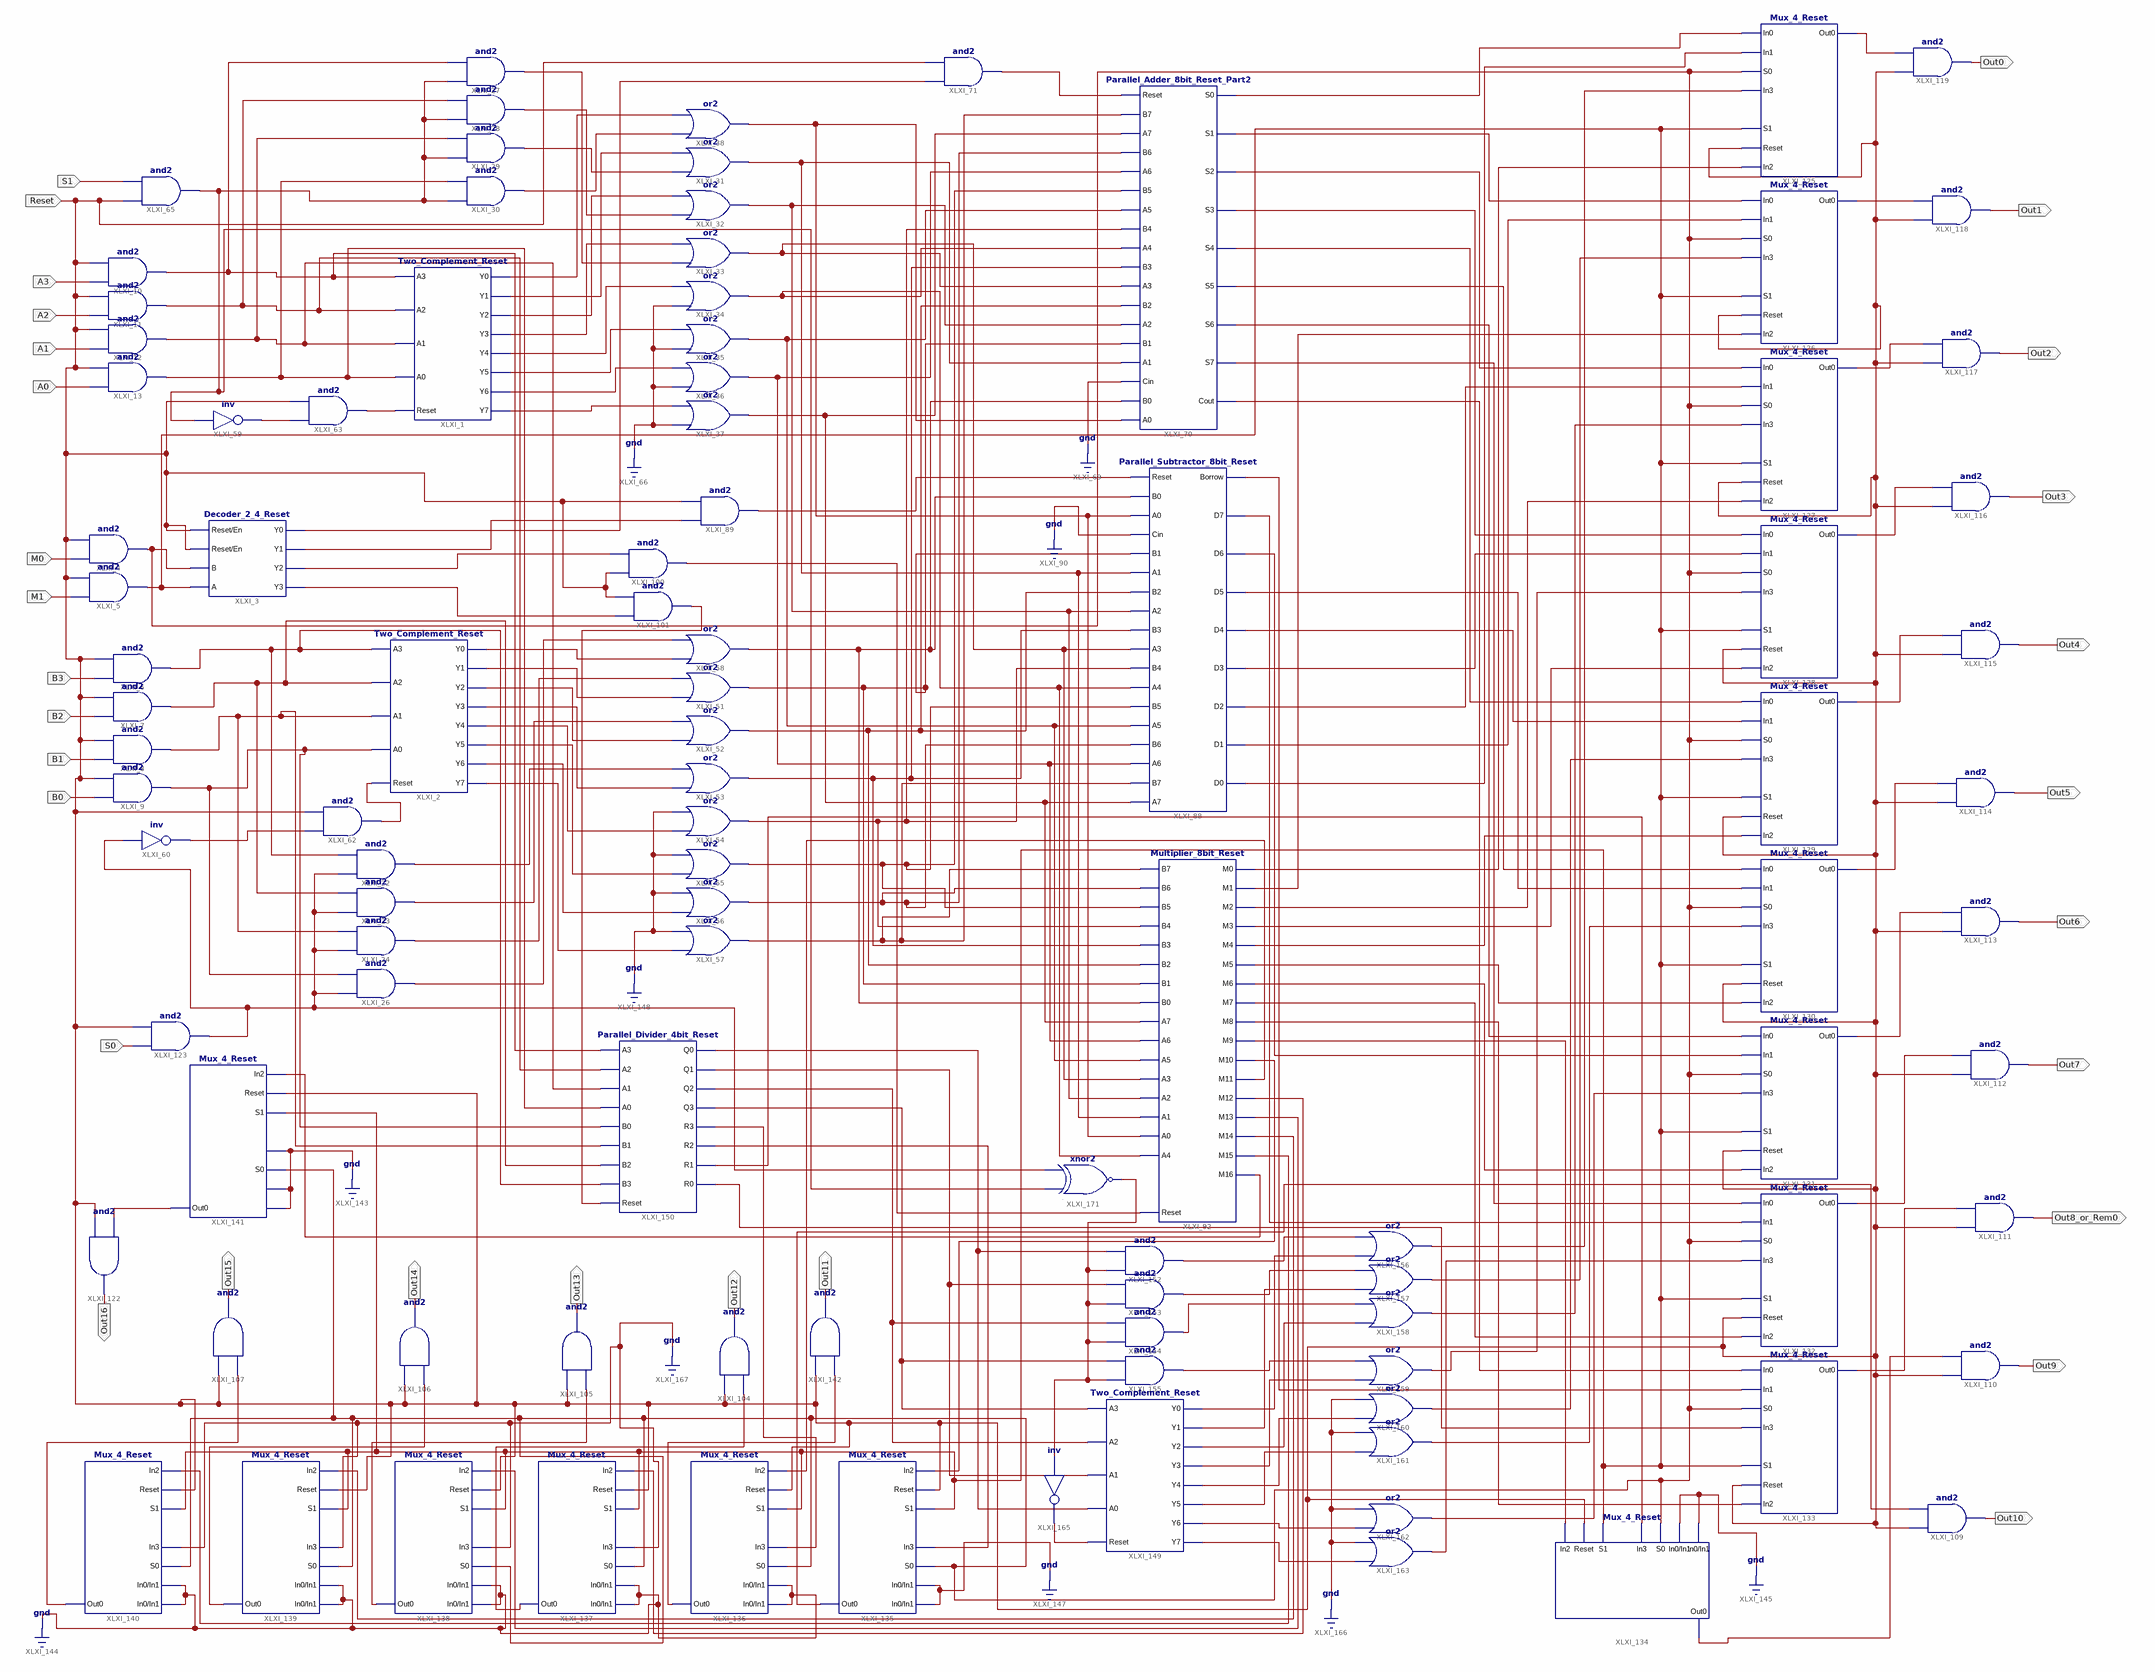
[diagram p0: schematic sheet 1]
// Xilinx ISE schematic Signed_Calculator_8bit_Reset_Part2.sch (artix7) as structural Verilog: 100 symbols, 30 ports
module Signed_Calculator_8bit_Reset_Part2 (
  input  M1,
  input  M0,
  input  A0,
  input  A1,
  input  A2,
  input  A3,
  input  B0,
  input  B1,
  input  B2,
  input  B3,
  input  S1,
  input  S0,
  input  Reset,
  output Out16,
  output Out15,
  output Out14,
  output Out13,
  output Out12,
  output Out10,
  output Out9,
  output Out8_or_Rem0,
  output Out7,
  output Out6,
  output Out5,
  output Out4,
  output Out3,
  output Out2,
  output Out1,
  output Out0,
  output Out11
);

  wire XLXN_15, XLXN_16, XLXN_17, XLXN_18, XLXN_19, XLXN_20, XLXN_21, XLXN_23, XLXN_24, XLXN_25, XLXN_26,
       XLXN_27, XLXN_28, XLXN_29, XLXN_30, XLXN_31, XLXN_32, XLXN_33, XLXN_34, XLXN_35, XLXN_36, XLXN_37,
       XLXN_38, XLXN_39, XLXN_40, XLXN_42, XLXN_43, XLXN_44, XLXN_45, XLXN_46, XLXN_47, XLXN_90, XLXN_96,
       XLXN_97, XLXN_101, XLXN_106, XLXN_107, XLXN_126, XLXN_127, XLXN_144, XLXN_145, XLXN_169, XLXN_170,
       XLXN_177, XLXN_178, XLXN_179, XLXN_180, XLXN_181, XLXN_182, XLXN_183, XLXN_184, XLXN_207, XLXN_208,
       XLXN_209, XLXN_210, XLXN_211, XLXN_212, XLXN_236, XLXN_237, XLXN_239, XLXN_276, XLXN_335, XLXN_336,
       XLXN_352, XLXN_353, XLXN_354, XLXN_355, XLXN_356, XLXN_357, XLXN_358, XLXN_359, XLXN_360, XLXN_361,
       XLXN_362, XLXN_363, XLXN_365, XLXN_366, XLXN_367, XLXN_368, XLXN_369, XLXN_370, XLXN_371, XLXN_372,
       XLXN_373, XLXN_374, XLXN_375, XLXN_376, XLXN_377, XLXN_378, XLXN_379, XLXN_385, XLXN_387, XLXN_388,
       XLXN_389, XLXN_390, XLXN_408, XLXN_449, XLXN_450, XLXN_451, XLXN_452, XLXN_453, XLXN_454, XLXN_455,
       XLXN_456, XLXN_457, XLXN_458, XLXN_460, XLXN_461, XLXN_462, XLXN_463, XLXN_464, XLXN_465, XLXN_473,
       XLXN_479, XLXN_1010, XLXN_1016, XLXN_1017, XLXN_1018, XLXN_1019, XLXN_1020, XLXN_1024, XLXN_1025,
       XLXN_1026, XLXN_1027, XLXN_1028, XLXN_1029, XLXN_1030, XLXN_1031, XLXN_1032, XLXN_1033, XLXN_1034,
       XLXN_1035, XLXN_1036, XLXN_1041, XLXN_1042, XLXN_1043, XLXN_1046, XLXN_1047, XLXN_1048, XLXN_1049,
       XLXN_1050, XLXN_1052, XLXN_1053, XLXN_1054, XLXN_1055, XLXN_1061;

  Two_Complement_Reset XLXI_1 (
    .A3(XLXN_15), .A2(XLXN_16), .A1(XLXN_17), .A0(XLXN_18), .Reset(XLXN_97), .Y0(XLXN_27), .Y1(XLXN_28),
    .Y2(XLXN_29), .Y3(XLXN_30), .Y4(XLXN_31), .Y5(XLXN_32), .Y6(XLXN_33), .Y7(XLXN_34));
  Two_Complement_Reset XLXI_2 (
    .A3(XLXN_19), .A2(XLXN_20), .A1(XLXN_21), .A0(XLXN_106), .Reset(XLXN_101), .Y0(XLXN_39), .Y1(XLXN_40),
    .Y2(XLXN_42), .Y3(XLXN_43), .Y4(XLXN_44), .Y5(XLXN_45), .Y6(XLXN_46), .Y7(XLXN_47));
  Decoder_2_4_Reset XLXI_3 (
    .Reset(Reset), .En(Reset), .B(XLXN_473), .A(XLXN_408), .Y0(XLXN_126), .Y1(XLXN_145), .Y2(XLXN_236),
    .Y3(XLXN_237));
  and XLXI_4 (XLXN_473, M0, Reset);
  and XLXI_5 (XLXN_408, M1, Reset);
  and XLXI_6 (XLXN_19, B3, Reset);
  and XLXI_7 (XLXN_20, B2, Reset);
  and XLXI_8 (XLXN_21, B1, Reset);
  and XLXI_9 (XLXN_106, B0, Reset);
  and XLXI_10 (XLXN_15, A3, Reset);
  and XLXI_11 (XLXN_16, A2, Reset);
  and XLXI_12 (XLXN_17, A1, Reset);
  and XLXI_13 (XLXN_18, A0, Reset);
  or XLXI_31 (XLXN_183, XLXN_24, XLXN_28);
  or XLXI_32 (XLXN_182, XLXN_25, XLXN_29);
  or XLXI_33 (XLXN_181, XLXN_26, XLXN_30);
  or XLXI_34 (XLXN_180, 1'b0, XLXN_31);
  or XLXI_35 (XLXN_179, 1'b0, XLXN_32);
  or XLXI_36 (XLXN_178, 1'b0, XLXN_33);
  or XLXI_37 (XLXN_177, 1'b0, XLXN_34);
  or XLXI_38 (XLXN_184, XLXN_23, XLXN_27);
  and XLXI_22 (XLXN_38, XLXN_1010, XLXN_19);
  and XLXI_23 (XLXN_37, XLXN_1010, XLXN_20);
  and XLXI_24 (XLXN_36, XLXN_1010, XLXN_21);
  and XLXI_26 (XLXN_35, XLXN_1010, XLXN_106);
  or XLXI_51 (XLXN_170, XLXN_40, XLXN_36);
  or XLXI_52 (XLXN_207, XLXN_42, XLXN_37);
  or XLXI_53 (XLXN_208, XLXN_43, XLXN_38);
  or XLXI_54 (XLXN_209, XLXN_44, 1'b0);
  or XLXI_55 (XLXN_210, XLXN_45, 1'b0);
  or XLXI_56 (XLXN_211, XLXN_46, 1'b0);
  or XLXI_57 (XLXN_212, XLXN_47, 1'b0);
  or XLXI_58 (XLXN_169, XLXN_39, XLXN_35);
  not XLXI_60 (XLXN_107, XLXN_1010);
  and XLXI_62 (XLXN_101, XLXN_107, Reset);
  and XLXI_63 (XLXN_97, XLXN_96, Reset);
  not XLXI_59 (XLXN_96, XLXN_90);
  and XLXI_27 (XLXN_26, XLXN_90, XLXN_15);
  and XLXI_28 (XLXN_25, XLXN_90, XLXN_16);
  and XLXI_29 (XLXN_24, XLXN_90, XLXN_17);
  and XLXI_30 (XLXN_23, XLXN_90, XLXN_18);
  and XLXI_65 (XLXN_90, Reset, S1);
  Parallel_Adder_8bit_Reset_Part2 XLXI_70 (
    .Reset(XLXN_127), .B7(XLXN_212), .A7(XLXN_177), .B6(XLXN_211), .A6(XLXN_178), .B5(XLXN_210),
    .A5(XLXN_179), .B4(XLXN_209), .A4(XLXN_180), .B3(XLXN_208), .A3(XLXN_181), .B2(XLXN_207), .A2(XLXN_182),
    .B1(XLXN_170), .A1(XLXN_183), .Cin(1'b0), .B0(XLXN_169), .A0(XLXN_184), .S0(XLXN_335), .S1(XLXN_353),
    .S2(XLXN_354), .S3(XLXN_355), .S4(XLXN_356), .S5(XLXN_357), .S6(XLXN_358), .S7(XLXN_359), .Cout(XLXN_360));
  and XLXI_71 (XLXN_127, XLXN_126, Reset);
  Parallel_Subtractor_8bit_Reset XLXI_88 (
    .Reset(XLXN_144), .B0(XLXN_169), .A0(XLXN_184), .Cin(1'b0), .B1(XLXN_170), .A1(XLXN_183), .B2(XLXN_207),
    .A2(XLXN_182), .B3(XLXN_208), .A3(XLXN_181), .B4(XLXN_209), .A4(XLXN_180), .B5(XLXN_210), .A5(XLXN_179),
    .B6(XLXN_211), .A6(XLXN_178), .B7(XLXN_212), .A7(XLXN_177), .Borrow(XLXN_369), .D7(XLXN_368),
    .D6(XLXN_367), .D5(XLXN_366), .D4(XLXN_365), .D3(XLXN_363), .D2(XLXN_362), .D1(XLXN_361), .D0(XLXN_336));
  Multiplier_8bit_Reset XLXI_92 (
    .B7(XLXN_212), .B6(XLXN_211), .B5(XLXN_210), .B4(XLXN_209), .B3(XLXN_208), .B2(XLXN_207), .B1(XLXN_170),
    .B0(XLXN_169), .A7(XLXN_177), .A6(XLXN_178), .A5(XLXN_179), .A2(XLXN_182), .A1(XLXN_183), .A0(XLXN_184),
    .A4(XLXN_180), .A3(XLXN_181), .M0(XLXN_352), .M1(XLXN_370), .M2(XLXN_371), .M3(XLXN_372), .M4(XLXN_373),
    .M5(XLXN_374), .M6(XLXN_375), .M7(XLXN_376), .M8(XLXN_377), .M9(XLXN_378), .M10(XLXN_379),
    .M11(XLXN_479), .M12(XLXN_385), .M13(XLXN_387), .M14(XLXN_388), .M15(XLXN_389), .M16(XLXN_390),
    .Reset(XLXN_239));
  and XLXI_100 (XLXN_239, Reset, XLXN_236);
  and XLXI_101 (XLXN_1061, XLXN_237, Reset);
  and XLXI_89 (XLXN_144, XLXN_145, Reset);
  and XLXI_104 (Out12, XLXN_461, Reset);
  and XLXI_105 (Out13, XLXN_462, Reset);
  and XLXI_106 (Out14, XLXN_463, Reset);
  and XLXI_107 (Out15, XLXN_464, Reset);
  and XLXI_109 (Out10, Reset, XLXN_458);
  and XLXI_110 (Out9, Reset, XLXN_457);
  and XLXI_111 (Out8_or_Rem0, Reset, XLXN_456);
  and XLXI_112 (Out7, Reset, XLXN_455);
  and XLXI_113 (Out6, Reset, XLXN_454);
  and XLXI_114 (Out5, Reset, XLXN_453);
  and XLXI_115 (Out4, Reset, XLXN_452);
  and XLXI_116 (Out3, Reset, XLXN_451);
  and XLXI_117 (Out2, Reset, XLXN_450);
  and XLXI_118 (Out1, Reset, XLXN_449);
  and XLXI_119 (Out0, Reset, XLXN_276);
  and XLXI_122 (Out16, Reset, XLXN_465);
  and XLXI_123 (XLXN_1010, S0, Reset);
  Mux_4_Reset XLXI_125 (
    .In0(XLXN_335), .In1(XLXN_336), .S0(XLXN_473), .In2(XLXN_352), .In3(XLXN_1041), .S1(XLXN_408),
    .Reset(Reset), .Out0(XLXN_276));
  Mux_4_Reset XLXI_126 (
    .In0(XLXN_353), .In1(XLXN_361), .S0(XLXN_473), .In2(XLXN_370), .In3(XLXN_1042), .S1(XLXN_408),
    .Reset(Reset), .Out0(XLXN_449));
  Mux_4_Reset XLXI_127 (
    .In0(XLXN_354), .In1(XLXN_362), .S0(XLXN_473), .In2(XLXN_371), .In3(XLXN_1043), .S1(XLXN_408),
    .Reset(Reset), .Out0(XLXN_450));
  Mux_4_Reset XLXI_128 (
    .In0(XLXN_355), .In1(XLXN_363), .S0(XLXN_473), .In2(XLXN_372), .In3(XLXN_1046), .S1(XLXN_408),
    .Reset(Reset), .Out0(XLXN_451));
  Mux_4_Reset XLXI_129 (
    .In0(XLXN_356), .In1(XLXN_365), .S0(XLXN_473), .In2(XLXN_373), .In3(XLXN_1047), .S1(XLXN_408),
    .Reset(Reset), .Out0(XLXN_452));
  Mux_4_Reset XLXI_130 (
    .In0(XLXN_357), .In1(XLXN_366), .S0(XLXN_473), .In2(XLXN_374), .In3(XLXN_1048), .S1(XLXN_408),
    .Reset(Reset), .Out0(XLXN_453));
  Mux_4_Reset XLXI_131 (
    .In0(XLXN_358), .In1(XLXN_367), .S0(XLXN_473), .In2(XLXN_375), .In3(XLXN_1049), .S1(XLXN_408),
    .Reset(Reset), .Out0(XLXN_454));
  Mux_4_Reset XLXI_132 (
    .In0(XLXN_359), .In1(XLXN_368), .S0(XLXN_473), .In2(XLXN_376), .In3(XLXN_1050), .S1(XLXN_408),
    .Reset(Reset), .Out0(XLXN_455));
  Mux_4_Reset XLXI_133 (
    .In0(XLXN_360), .In1(XLXN_369), .S0(XLXN_473), .In2(XLXN_377), .In3(XLXN_1052), .S1(XLXN_408),
    .Reset(Reset), .Out0(XLXN_456));
  Mux_4_Reset XLXI_135 (
    .In0(1'b0), .In1(1'b0), .S0(XLXN_473), .In2(XLXN_379), .In3(XLXN_1054), .S1(XLXN_408), .Reset(Reset),
    .Out0(XLXN_458));
  Mux_4_Reset XLXI_136 (
    .In0(1'b0), .In1(1'b0), .S0(XLXN_473), .In2(XLXN_479), .In3(XLXN_1055), .S1(XLXN_408), .Reset(Reset),
    .Out0(XLXN_460));
  Mux_4_Reset XLXI_137 (
    .In0(1'b0), .In1(1'b0), .S0(XLXN_473), .In2(XLXN_385), .In3(1'b0), .S1(XLXN_408), .Reset(Reset),
    .Out0(XLXN_461));
  Mux_4_Reset XLXI_138 (
    .In0(1'b0), .In1(1'b0), .S0(XLXN_473), .In2(XLXN_387), .In3(1'b0), .S1(XLXN_408), .Reset(Reset),
    .Out0(XLXN_462));
  Mux_4_Reset XLXI_139 (
    .In0(1'b0), .In1(1'b0), .S0(XLXN_473), .In2(XLXN_388), .In3(1'b0), .S1(XLXN_408), .Reset(Reset),
    .Out0(XLXN_463));
  Mux_4_Reset XLXI_140 (
    .In0(1'b0), .In1(1'b0), .S0(XLXN_473), .In2(XLXN_389), .In3(1'b0), .S1(XLXN_408), .Reset(Reset),
    .Out0(XLXN_464));
  Mux_4_Reset XLXI_141 (
    .In0(1'b0), .In1(1'b0), .S0(XLXN_473), .In2(XLXN_390), .In3(1'b0), .S1(XLXN_408), .Reset(Reset),
    .Out0(XLXN_465));
  and XLXI_142 (Out11, XLXN_460, Reset);
  Mux_4_Reset XLXI_134 (
    .In0(1'b0), .In1(1'b0), .S0(XLXN_473), .In2(XLXN_378), .In3(XLXN_1053), .S1(XLXN_408), .Reset(Reset),
    .Out0(XLXN_457));
  Two_Complement_Reset XLXI_149 (
    .A3(XLXN_1019), .A2(XLXN_1018), .A1(XLXN_1017), .A0(XLXN_1016), .Reset(XLXN_1024), .Y0(XLXN_1029),
    .Y1(XLXN_1030), .Y2(XLXN_1031), .Y3(XLXN_1032), .Y4(XLXN_1033), .Y5(XLXN_1034), .Y6(XLXN_1035),
    .Y7(XLXN_1036));
  Parallel_Divider_4bit_Reset XLXI_150 (
    .A3(XLXN_15), .A2(XLXN_16), .A1(XLXN_17), .A0(XLXN_18), .B0(XLXN_106), .B1(XLXN_21), .B2(XLXN_20),
    .B3(XLXN_19), .Reset(XLXN_1061), .Q0(XLXN_1016), .Q1(XLXN_1017), .Q2(XLXN_1018), .Q3(XLXN_1019),
    .R3(XLXN_1055), .R2(XLXN_1054), .R1(XLXN_1053), .R0(XLXN_1052));
  and XLXI_152 (XLXN_1025, XLXN_1020, XLXN_1016);
  and XLXI_153 (XLXN_1026, XLXN_1020, XLXN_1017);
  and XLXI_154 (XLXN_1027, XLXN_1020, XLXN_1018);
  and XLXI_155 (XLXN_1028, XLXN_1020, XLXN_1019);
  or XLXI_156 (XLXN_1041, XLXN_1029, XLXN_1025);
  or XLXI_157 (XLXN_1042, XLXN_1030, XLXN_1026);
  or XLXI_158 (XLXN_1043, XLXN_1031, XLXN_1027);
  or XLXI_159 (XLXN_1046, XLXN_1032, XLXN_1028);
  or XLXI_160 (XLXN_1047, XLXN_1033, 1'b0);
  or XLXI_161 (XLXN_1048, XLXN_1034, 1'b0);
  or XLXI_162 (XLXN_1049, XLXN_1035, 1'b0);
  or XLXI_163 (XLXN_1050, XLXN_1036, 1'b0);
  not XLXI_165 (XLXN_1024, XLXN_1020);
  xnor XLXI_171 (XLXN_1020, XLXN_90, XLXN_1010);
endmodule
